# Altium project Modulo Core MK1.PrjPcb (part 1 of 2)
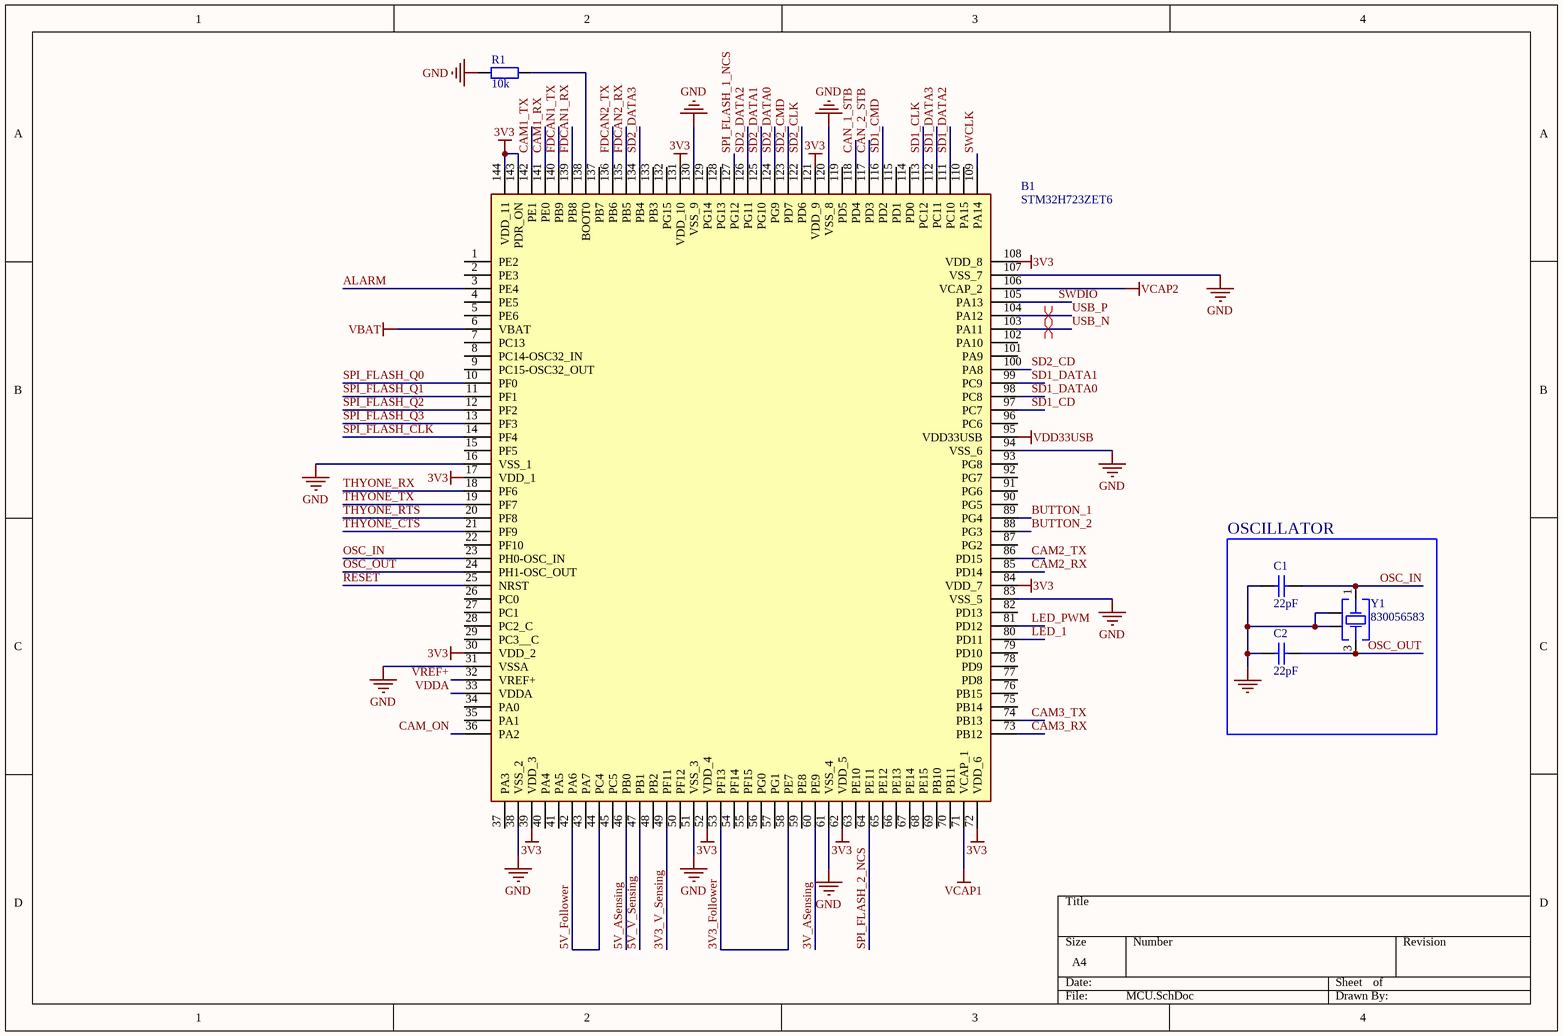
[diagram p0: MCU.SchDoc]
7 sheets, 122 parts. Net scope: global (net labels, ports and power ports of the same name join across sheets).
Board file: PCB_Core.PcbDoc
Sheets:
  MCU.SchDoc
  MCU_PWR.SchDoc
  Connectors.SchDoc
  Sensing.SchDoc
  Comms.SchDoc
  Storage.SchDoc
  Beacons.SchDoc

## Sheet MCU.SchDoc
size A4; SheetNumber: 1; SheetTotal: 7; SPICEModelCacheEMWNTBUM: <root> / <DocumentId>EMWNTBUM</DocumentId> / <CacheFrame Number="0"> / <Model Name="0603_885012006034_22pf" Kind="CKT"> / <Text>******* / .subckt 0603_885012006034_22pF 1 2 / Rser 1 3 0.352481322316 / Lser 2 4 5.8820344E-10 / C1 3 4 0.000000000022 / Rpar 3 4 10000000000 / .ends 0603_885012006034_22pF</Text> / </Model> / </CacheFrame> / </root>

### Parts
B1  STM32H723ZET6  [QFP50P2200X2200X160-144N]
C1  value 22pF  [WCAP-CSGP_0603_L1.6W0.8H0.8_Reflow]  (hidden comment: 885012006034)
C2  value 22pF  [WCAP-CSGP_0603_L1.6W0.8H0.8_Reflow]  (hidden comment: 885012006034)
R1  value 10k  [WRIS-RSKS_0603_Reflow]  (hidden comment: 560112116005)
Y1  830056583  [WE-XTAL_CFPX-104]

### Blocks framed on the sheet
OSCILLATOR: C1 C2 Y1

### Nets
3V3: B1.17(VDD_1) B1.30(VDD_2) B1.39(VDD_3) B1.52(VDD_4) B1.62(VDD_5) B1.72(VDD_6) B1.84(VDD_7) B1.108(VDD_8) B1.121(VDD_9) B1.131(VDD_10) B1.143(PDR_ON) B1.144(VDD_11)  [project net 3V3_Current-]
GND: B1.16(VSS_1) B1.31(VSSA) B1.38(VSS_2) B1.51(VSS_3) B1.61(VSS_4) B1.83(VSS_5) B1.94(VSS_6) B1.107(VSS_7) B1.120(VSS_8) B1.130(VSS_9) C1.2 C2.2 R1.2 Y1.2(GND_&_Lid) Y1.4(GND_&_Lid)
VBAT: B1.6(VBAT)
VCAP1: B1.71(VCAP_1)
VCAP2: B1.106(VCAP_2)
VDD33USB: B1.95(VDD33USB)
VDDA: B1.33(VDDA)
VREF+: B1.32(VREF+)
3V3_Follower: B1.53(PF13) B1.58(PE7)
3V3_V_Sensing: B1.49(PF11)
3V_ASensing: B1.60(PE9)
5V_ASensing: B1.46(PB0)
5V_Follower: B1.42(PA6) B1.44(PC4)
5V_V_Sensing: B1.47(PB1)
ALARM: B1.3(PE4)
BUTTON_1: B1.89(PG4)
BUTTON_2: B1.88(PG3)
CAM1_RX: B1.141(PE0)
CAM1_TX: B1.142(PE1)
CAM2_RX: B1.85(PD14)
CAM2_TX: B1.86(PD15)
CAM3_RX: B1.73(PB12)
CAM3_TX: B1.74(PB13)
CAM_ON: B1.36(PA2)
CAN_1_STB: B1.118(PD4)
CAN_2_STB: B1.117(PD3)
FDCAN1_RX: B1.139(PB8)
FDCAN1_TX: B1.140(PB9)
FDCAN2_RX: B1.135(PB5)
FDCAN2_TX: B1.136(PB6)
LED_1: B1.80(PD11)
LED_PWM: B1.81(PD12)
OSC_IN: B1.23(PH0-OSC_IN) C1.1 Y1.1(Crystal)
OSC_OUT: B1.24(PH1-OSC_OUT) C2.1 Y1.3(Crystal)
RESET: B1.25(NRST)
SD1_CD: B1.97(PC7)
SD1_CLK: B1.113(PC12)
SD1_CMD: B1.116(PD2)
SD1_DATA0: B1.98(PC8)
SD1_DATA1: B1.99(PC9)
SD1_DATA2: B1.111(PC10)
SD1_DATA3: B1.112(PC11)
SD2_CD: B1.100(PA8)
SD2_CLK: B1.122(PD6)
SD2_CMD: B1.123(PD7)
SD2_DATA0: B1.124(PG9)
SD2_DATA1: B1.125(PG10)
SD2_DATA2: B1.126(PG11)
SD2_DATA3: B1.134(PB4)
SPI_FLASH_1_NCS: B1.127(PG12)
SPI_FLASH_2_NCS: B1.64(PE11)
SPI_FLASH_CLK: B1.14(PF4)
SPI_FLASH_Q0: B1.10(PF0)
SPI_FLASH_Q1: B1.11(PF1)
SPI_FLASH_Q2: B1.12(PF2)
SPI_FLASH_Q3: B1.13(PF3)
SWCLK: B1.109(PA14)
SWDIO: B1.105(PA13)
THYONE_CTS: B1.21(PF9)
THYONE_RTS: B1.20(PF8)
THYONE_RX: B1.18(PF6)
THYONE_TX: B1.19(PF7)
USB_N: B1.103(PA11)
USB_P: B1.104(PA12)
NetB1_138: B1.138(BOOT0) R1.1

Not connected (* = marked no-connect by the designer): B1 1(PE2) 2(PE3) 4(PE5) 5(PE6) 7(PC13) 8(PC14-OSC32_IN) 9(PC15-OSC32_OUT) 15(PF5) 22(PF10) 26(PC0) 27(PC1) 28(PC2_C) 29(PC3__C) 34(PA0) 35(PA1) 37(PA3) 40(PA4) 41(PA5) 43(PA7) 45(PC5) 48(PB2) 50(PF12) 54(PF14) 55(PF15) 56(PG0) 57(PG1) 59(PE8) 63(PE10) 65(PE12) 66(PE13) 67(PE14) 68(PE15) 69(PB10) 70(PB11) 75(PB14) 76(PB15) 77(PD8) 78(PD9) 79(PD10) 82(PD13) 87(PG2) 90(PG5) 91(PG6) 92(PG7) 93(PG8) 96(PC6) 101(PA9) 102(PA10) 110(PA15) 114(PD0) 115(PD1) 119(PD5) 128(PG13) 129(PG14) 132(PG15) 133(PB3) 137(PB7)

### Layout directives
differential pair: USB_N, USB_P

### Library data of the parts
B1 = CMP-163-000000-3: High-performance and DSP with DP-FPU, Arm Cortex-M7 MCU with 512 Kbytes Flash, 564 Kbytes RAM, 550 MHz CPU, L1 cache, external memory interface, subset of peripherals; Manufacturer_Name: STMicroelectronics; Geometry.Height: 1.6mm; Source: STM32H723ZET6.SchLib; Mouser Price/Stock: https://www.mouser.co.uk/ProductDetail/STMicroelectronics/STM32H723ZET6?qs=sPbYRqrBIVnvdSB0MwAafg%3D%3D; Datasheet Link: https://www.st.com/resource/en/datasheet/stm32h723ve.pdf; Manufacturer_Part_Number: STM32H723ZET6; Mouser Part Number: 511-STM32H723ZET6; Design Item ID: STM32H723ZET6
C1 C2 = CMP-001-00150-1: WCAP-CSGP Multilayer Ceramic Chip Capacitor, General Purpose, size 0603, NP0, 22pF, 25VDC; Manufacturer: Wurth Elektronik; Q Factor: 840; Capacitance Tolerance: +/-5%; Insulation Resistance: 10GOhm; Technical Reference: NP00603220J025DFCT10000; Rated Voltage (DC): 25V; Category: Multilayer Ceramic Chip Capacitors; ComponentLink2URL: https://www.we-online.com/redexpert/spec/885012006034?ad; ComponentLink1Description: Website Link; Operating Temperature Max: 125°C; Ceramic Type: NP0; Operating Temperature Min: -55°C; Case/Package: 0603; Component Type: Standard; Width: 0.8mm; Source: WCAP-CSGP.SchLib; Pins: 2; Packaging: Tape and Reel; Mount: Surface Mount; ComponentLink2Description: Datasheet Link; ComponentLink1URL: https://www.we-online.com/redexpert/article/885012006034?ad; Manufacturer Part Number: 885012006034; Match Code: WCAP-CSGP; Design Item ID: 885012006034; Length: 1.6mm; Height: 0.8mm
R1 = CMP-009-00328-1: WRIS-RSKS Thick Film Resistor, size 0603, 10000Ohm, 100mW; Manufacturer: Wurth Elektronik; Limiting Element Voltage: 75V; Temperature Coefficient of Resistance Max: 100ppm/°C; Resistance Tolerance: +/-1%; Temperature Coefficient of Resistance Min: -100ppm/°C; ComponentLink1Description: Website Link; Case/Package: 0603; Pins: 2; Match Code: WRIS-RSKS; Operating Temperature Max: 155°C; Width: 0.8mm; Design Item ID: 560112116005; Length: 1.6mm; ComponentLink2Description: Datasheet Link; ComponentLink2URL: https://www.we-online.com/redexpert/spec/560112116005?ad; Packaging: Tape and Reel; Source: WRIS-RSKS.SchLib; Height: 0.45mm; Manufacturer Part Number: 560112116005; Component Type: Standard; Mount: Surface Mount; Operating Temperature Min: -55°C; Rated Power: 100mW; ComponentLink1URL: https://www.we-online.com/redexpert/article/560112116005?ad; Category: Thick Film Resistors
Y1 = CMP-003-00170-1: WE-XTAL Quartz Crystal, SMT, CFPX-104, 10MHz, +/-30ppm; Manufacturer: Wurth Elektronik; Load Capacitance: 12pF; Component Type: Standard; Operating Temperature Min: -40°C; Pins: 4; ComponentLink2URL: https://www.we-online.com/redexpert/spec/830056583?ad; Frequency Tolerance: +/-30ppm; Packaging: Tape and Reel; Match Code: WE-XTAL; Frequency Stability: +/-30ppm; ComponentLink1URL: https://www.we-online.com/redexpert/article/830056583?ad; Mount: Surface Mount; ComponentLink1Description: Website Link; Source: WE-XTAL.SchLib; Length: 5mm; Manufacturer Part Number: 830056583; Width: 3.2mm; Design Item ID: 830056583; Height: 1mm; Frequency: 10MHz; Operating Temperature Max: 85°C; Case/Package: CFPX-104; ComponentLink2Description: Datasheet Link; Category: Crystals

## Sheet MCU_PWR.SchDoc
size A4; SheetNumber: 2; SheetTotal: 7; SPICEModelCacheOZNVDSOE: <root> / <DocumentId>OZNVDSOE</DocumentId> / <CacheFrame Number="0"> / <Model Name="0603_885012206071_100nf" Kind="CKT"> / <Text>******* / .subckt 0603_885012206071_100nF 1 2 / Rser 1 3 0.025 / Lser 2 4 0.0000000008 / C1 3 4 0.0000001 / Rpar 3 4 5000000000 / .ends 0603_885012206071_100nF</Text> / </Model> / <Model Name="0603_885012206052_1uf" Kind="CKT"> / <Text>******* / .subckt 0603_885012206052_1uF 1 2 / Rser 1 3 0.00742821402486 / Lser 2 4 2.51142993E-10 / C1 3 4 0.000001 / Rpar 3 4 100000000 / .ends 0603_885012206052_1uF</Text> / </Model> / <Model Name="0603_885012106012_4.7uf" Kind="CKT"> / <Text>******* / .subckt 0603_885012106012_4.7uF 1 2 / Rser 1 3 0.00455496693599 / Lser 2 4 5.03384516E-10 / C1 3 4 0.0000047 / Rpar 3 4 20000000 / .ends 0603_885012106012_4.7uF</Text> / </Model> / <Model Name="0603_885012106018_2.2uf" Kind="CKT"> / <Text>******* / .subckt 0603_885012106018_2.2uF 1 2 / Rser 1 3 0.00721183501635 / Lser 2 4 2.59345303E-10 / C1 3 4 0.0000022 / Rpar 3 4 50000000 / .ends 0603_885012106018_2.2uF</Text> / </Model> / </CacheFrame> / </root>
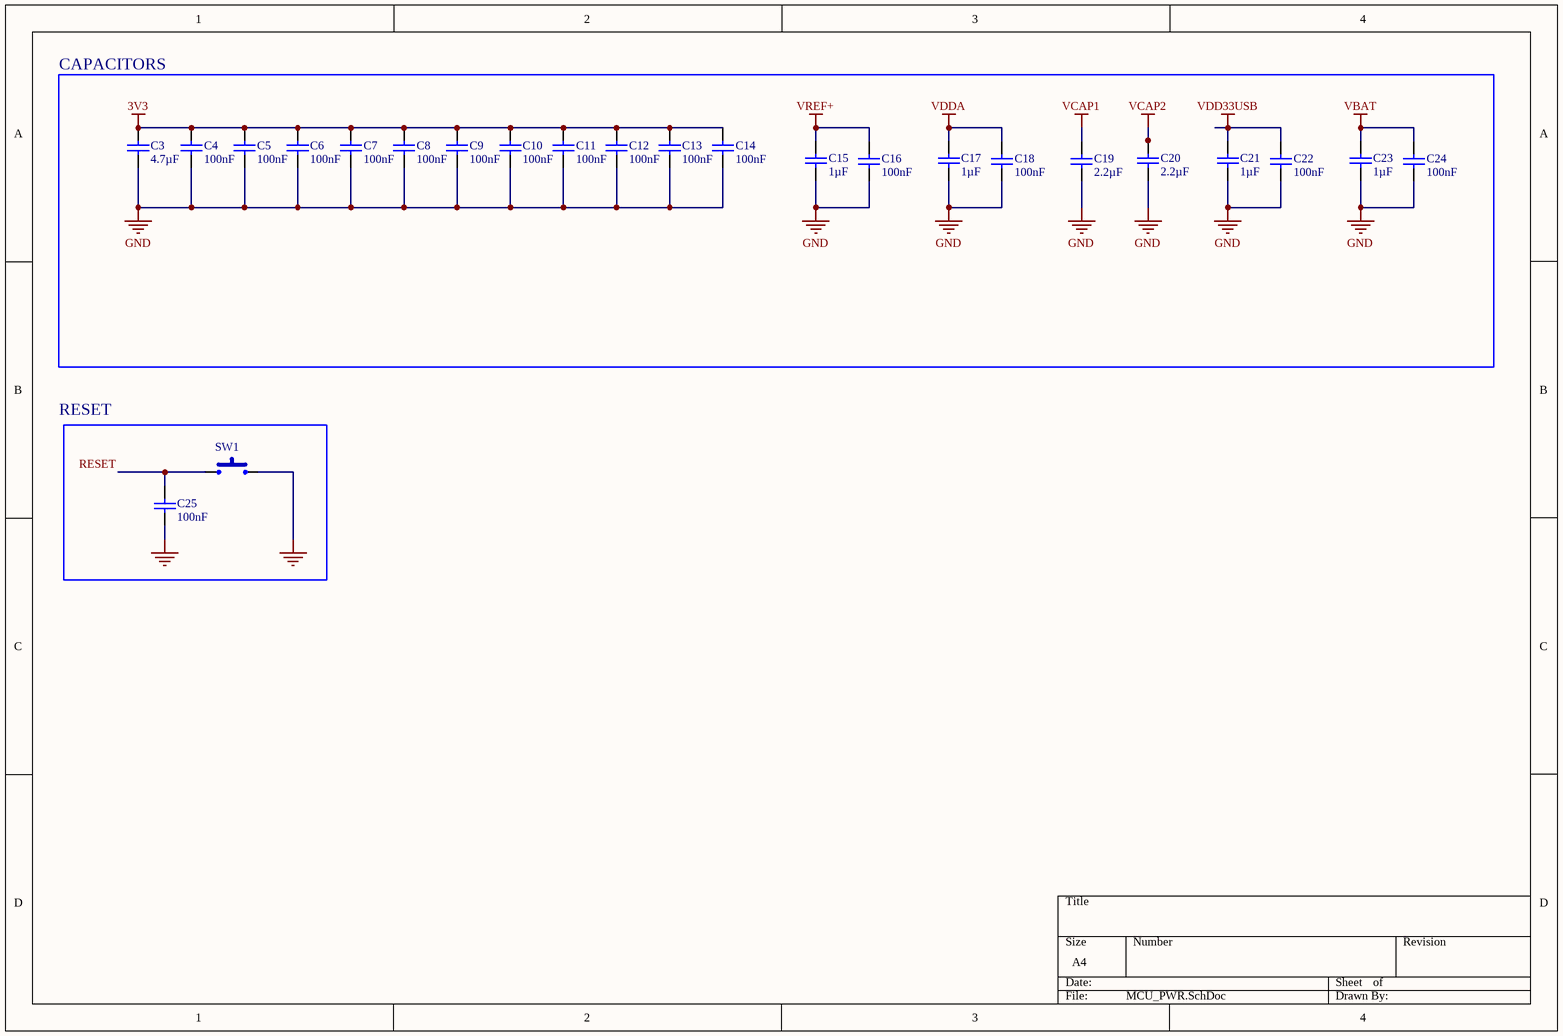
[diagram p1: MCU_PWR.SchDoc]

### Parts
C3  value 4.7µF  [WCAP-CSGP_0603_L1.6W0.8H0.8_Reflow]  (hidden comment: 885012106012)
C4  value 100nF  [WCAP-CSGP_0603_L1.6W0.8H0.8_Reflow]  (hidden comment: 885012206071)
C5  value 100nF  [WCAP-CSGP_0603_L1.6W0.8H0.8_Reflow]  (hidden comment: 885012206071)
C6  value 100nF  [WCAP-CSGP_0603_L1.6W0.8H0.8_Reflow]  (hidden comment: 885012206071)
C7  value 100nF  [WCAP-CSGP_0603_L1.6W0.8H0.8_Reflow]  (hidden comment: 885012206071)
C8  value 100nF  [WCAP-CSGP_0603_L1.6W0.8H0.8_Reflow]  (hidden comment: 885012206071)
C9  value 100nF  [WCAP-CSGP_0603_L1.6W0.8H0.8_Reflow]  (hidden comment: 885012206071)
C10  value 100nF  [WCAP-CSGP_0603_L1.6W0.8H0.8_Reflow]  (hidden comment: 885012206071)
C11  value 100nF  [WCAP-CSGP_0603_L1.6W0.8H0.8_Reflow]  (hidden comment: 885012206071)
C12  value 100nF  [WCAP-CSGP_0603_L1.6W0.8H0.8_Reflow]  (hidden comment: 885012206071)
C13  value 100nF  [WCAP-CSGP_0603_L1.6W0.8H0.8_Reflow]  (hidden comment: 885012206071)
C14  value 100nF  [WCAP-CSGP_0603_L1.6W0.8H0.8_Reflow]  (hidden comment: 885012206071)
C15  value 1µF  [WCAP-CSGP_0603_L1.6W0.8H0.8_Reflow]  (hidden comment: 885012206052)
C16  value 100nF  [WCAP-CSGP_0603_L1.6W0.8H0.8_Reflow]  (hidden comment: 885012206071)
C17  value 1µF  [WCAP-CSGP_0603_L1.6W0.8H0.8_Reflow]  (hidden comment: 885012206052)
C18  value 100nF  [WCAP-CSGP_0603_L1.6W0.8H0.8_Reflow]  (hidden comment: 885012206071)
C19  value 2.2µF  [WCAP-CSGP_0603_L1.6W0.8H0.8_Reflow]  (hidden comment: 885012106018)
C20  value 2.2µF  [WCAP-CSGP_0603_L1.6W0.8H0.8_Reflow]  (hidden comment: 885012106018)
C21  value 1µF  [WCAP-CSGP_0603_L1.6W0.8H0.8_Reflow]  (hidden comment: 885012206052)
C22  value 100nF  [WCAP-CSGP_0603_L1.6W0.8H0.8_Reflow]  (hidden comment: 885012206071)
C23  value 1µF  [WCAP-CSGP_0603_L1.6W0.8H0.8_Reflow]  (hidden comment: 885012206052)
C24  value 100nF  [WCAP-CSGP_0603_L1.6W0.8H0.8_Reflow]  (hidden comment: 885012206071)
C25  value 100nF  [WCAP-CSGP_0603_L1.6W0.8H0.8_Reflow]  (hidden comment: 885012206071)
SW1  PTS815SJM250SMTRLFS  [PTS815SJM250SMTRLFS-Footprint-1]  (value not drawn)

### Blocks framed on the sheet
CAPACITORS: C3-C24

### Nets
3V3: C3.1 C4.1 C5.1 C6.1 C7.1 C8.1 C9.1 C10.1 C11.1 C12.1 C13.1 C14.1  [project net 3V3_Current-]
GND: C3.2 C4.2 C5.2 C6.2 C7.2 C8.2 C9.2 C10.2 C11.2 C12.2 C13.2 C14.2 C15.2 C16.2 C17.2 C18.2 C19.1 C20.1 C21.2 C22.2 C23.2 C24.2 C25.1 SW1.2
VBAT: C23.1 C24.1
VCAP1: C19.2
VCAP2: C20.2
VDD33USB: C21.1 C22.1
VDDA: C17.1 C18.1
VREF+: C15.1 C16.1
RESET: C25.2 SW1.1

### Notes on the sheet
- RESET

### Library data of the parts
C3 = CMP-001-00440-1: WCAP-CSGP Multilayer Ceramic Chip Capacitor, General Purpose, size 0603, X5R, 4.7uF, 10VDC; Manufacturer: Wurth Elektronik; Rated Voltage (DC): 10V; Technical Reference: X5R0603475M010DFCT10000; Dissipation Factor: 10%; Insulation Resistance: 0.02GOhm; Capacitance Tolerance: +/-20%; ComponentLink2URL: https://www.we-online.com/redexpert/spec/885012106012?ad; Height: 0.8mm; Packaging: Tape and Reel; Case/Package: 0603; Manufacturer Part Number: 885012106012; Component Type: Standard; Width: 0.8mm; Match Code: WCAP-CSGP; Mount: Surface Mount; Ceramic Type: X5R; Operating Temperature Max: 85°C; ComponentLink1Description: Website Link; Length: 1.6mm; ComponentLink1URL: https://www.we-online.com/redexpert/article/885012106012?ad; ComponentLink2Description: Datasheet Link; Category: Multilayer Ceramic Chip Capacitors; Source: WCAP-CSGP.SchLib; Operating Temperature Min: -55°C; Pins: 2; Design Item ID: 885012106012
C4-C14 C16 C18 C22 C24 C25 = CMP-001-00661-1: WCAP-CSGP Multilayer Ceramic Chip Capacitor, General Purpose, size 0603, X7R, 100nF, 25VDC; Manufacturer: Wurth Elektronik; Dissipation Factor: 3.5%; Capacitance Tolerance: +/-10%; Insulation Resistance: 5GOhm; Technical Reference: X7R0603104K025DFCT10000; Rated Voltage (DC): 25V; Packaging: Tape and Reel; Height: 0.8mm; Mount: Surface Mount; Source: WCAP-CSGP.SchLib; Component Type: Standard; Category: Multilayer Ceramic Chip Capacitors; Operating Temperature Min: -55°C; Case/Package: 0603; ComponentLink2Description: Datasheet Link; Width: 0.8mm; ComponentLink1URL: https://www.we-online.com/redexpert/article/885012206071?ad; Length: 1.6mm; Operating Temperature Max: 125°C; Match Code: WCAP-CSGP; ComponentLink2URL: https://www.we-online.com/redexpert/spec/885012206071?ad; Design Item ID: 885012206071; ComponentLink1Description: Website Link; Manufacturer Part Number: 885012206071; Pins: 2; Ceramic Type: X7R
C15 C17 C21 C23 = CMP-001-00642-1: WCAP-CSGP Multilayer Ceramic Chip Capacitor, General Purpose, size 0603, X7R, 1uF, 16VDC; Manufacturer: Wurth Elektronik; Capacitance Tolerance: +/-10%; Insulation Resistance: 0.1GOhm; Rated Voltage (DC): 16V; Dissipation Factor: 10%; Technical Reference: X7R0603105K016DFCT10000; Component Type: Standard; Width: 0.8mm; Ceramic Type: X7R; ComponentLink1Description: Website Link; ComponentLink1URL: https://www.we-online.com/redexpert/article/885012206052?ad; Height: 0.8mm; Manufacturer Part Number: 885012206052; Match Code: WCAP-CSGP; Source: WCAP-CSGP.SchLib; Case/Package: 0603; Operating Temperature Min: -55°C; ComponentLink2Description: Datasheet Link; Design Item ID: 885012206052; ComponentLink2URL: https://www.we-online.com/redexpert/spec/885012206052?ad; Category: Multilayer Ceramic Chip Capacitors; Packaging: Tape and Reel; Pins: 2; Length: 1.6mm; Operating Temperature Max: 125°C; Mount: Surface Mount
C19 C20 = CMP-001-00446-1: WCAP-CSGP Multilayer Ceramic Chip Capacitor, General Purpose, size 0603, X5R, 2.2uF, 16VDC; Manufacturer: Wurth Elektronik; Rated Voltage (DC): 16V; Insulation Resistance: 0.05GOhm; Dissipation Factor: 10%; Technical Reference: X5R0603225M016DFCT10000; Capacitance Tolerance: +/-20%; Height: 0.8mm; Length: 1.6mm; Packaging: Tape and Reel; Match Code: WCAP-CSGP; Ceramic Type: X5R; Category: Multilayer Ceramic Chip Capacitors; Source: WCAP-CSGP.SchLib; Width: 0.8mm; Design Item ID: 885012106018; Case/Package: 0603; Mount: Surface Mount; Component Type: Standard; Pins: 2; ComponentLink1URL: https://www.we-online.com/redexpert/article/885012106018?ad; Operating Temperature Min: -55°C; ComponentLink1Description: Website Link; Operating Temperature Max: 85°C; Manufacturer Part Number: 885012106018; ComponentLink2URL: https://www.we-online.com/redexpert/spec/885012106018?ad; ComponentLink2Description: Datasheet Link
SW1 = CMP-011-00002-1: Keypad Switch, 1 Switches, SPST, Momentary-tactile, 0.05A, 12VDC, 2.26N, Solder Terminal, Surface Mount-straight

## Sheet Connectors.SchDoc
size A4; SheetNumber: 3; SheetTotal: 7; SPICEModelCacheZWOSRZDM: <root> / <DocumentId>ZWOSRZDM</DocumentId> / </root>
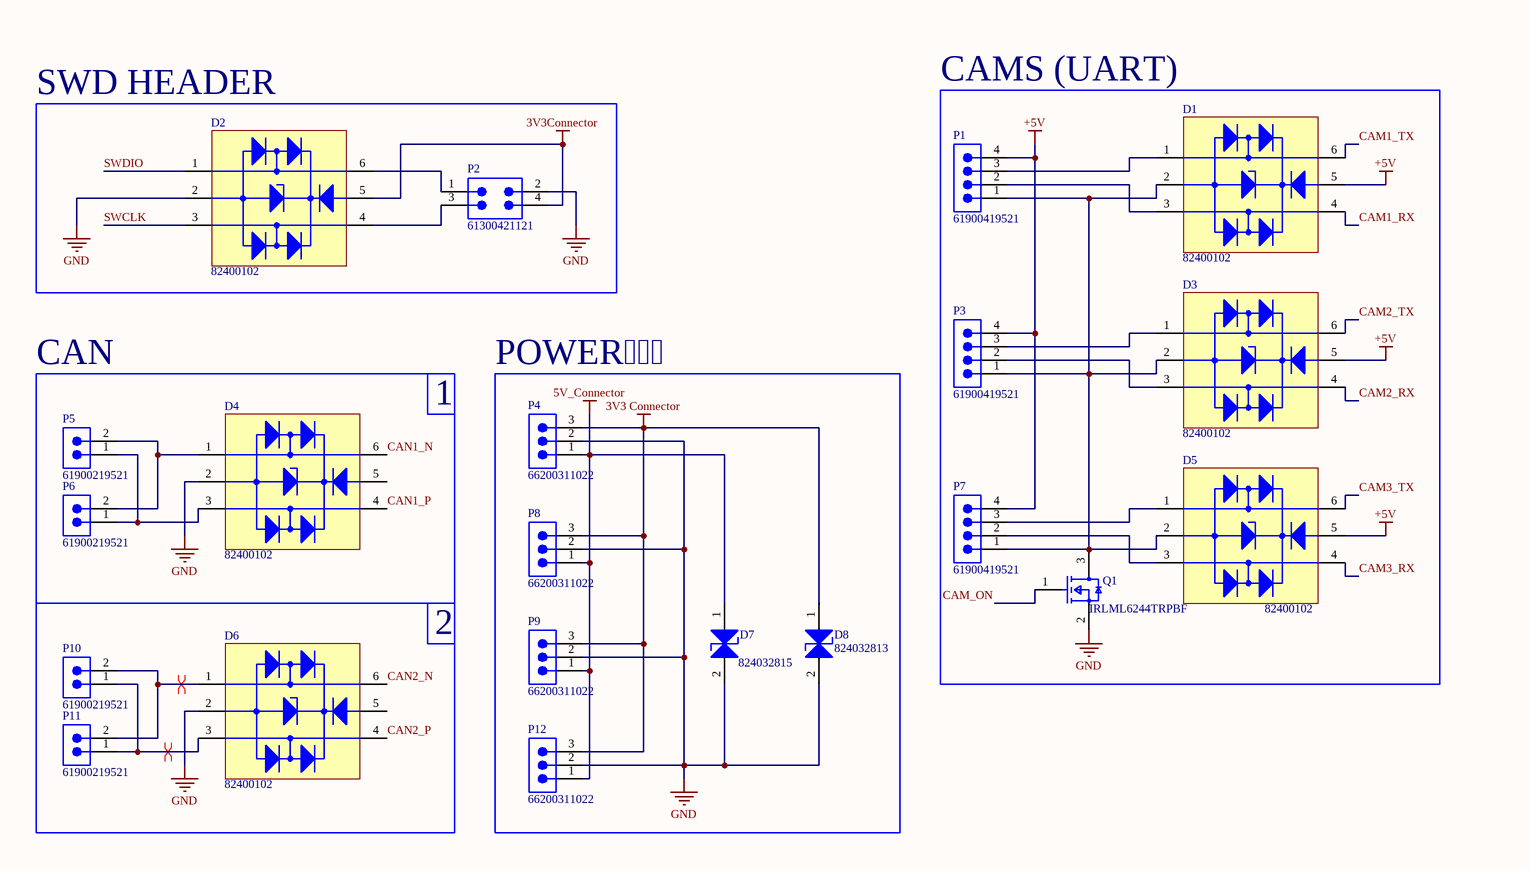
[diagram p2: Connectors.SchDoc, left]
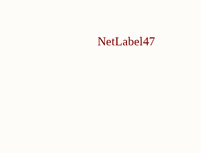
[diagram p3: Connectors.SchDoc, right]

### Parts
D1  82400102  [WE-TVS_SOT23-6L]
D2  82400102  [WE-TVS_SOT23-6L]
D3  82400102  [WE-TVS_SOT23-6L]
D4  82400102  [WE-TVS_SOT23-6L]
D5  82400102  [WE-TVS_SOT23-6L]
D6  82400102  [WE-TVS_SOT23-6L]
D7  824032815  [WE-TVS_DFN1610-2L]
D8  824032813  [WE-TVS_DFN1610-2L]
P1  61900419521  [61900419521]
P2  61300421121  [61300421121]
P3  61900419521  [61900419521]
P4  66200311022  [66200311022]
P5  61900219521  [61900219521]
P6  61900219521  [61900219521]
P7  61900419521  [61900419521]
P8  66200311022  [66200311022]
P9  66200311022  [66200311022]
P10  61900219521  [61900219521]
P11  61900219521  [61900219521]
P12  66200311022  [66200311022]
Q1  IRLML6244TRPBF  [FP-Micro3-IPC_C]

### Blocks framed on the sheet
CAMS (UART): D1 D3 D5 P1 P3 P7 Q1
SWD HEADER: D2 P2
POWER: D7 D8 P4 P8 P9 P12

### Nets
3V3 Connector: D8.1(I/O_1) P4.3 P8.3 P9.3 P12.3  [project net 3V3_Current+]
3V3Connector: D2.5(VDD) P2.4
5V_Connector: D7.1(I/O_1) P4.1 P8.1 P9.1 P12.1  [project net 5V_Current+]
+5V: D1.5(VDD) D3.5(VDD) D5.5(VDD) P1.4 P3.4 P7.4  [project net 5V_Current-]
GND: D2.2(GND) D4.2(GND) D6.2(GND) D7.2(GND) D8.2(GND) P2.2 P4.2 P8.2 P9.2 P12.2 Q1.2(S)
CAM1_RX: D1.4(I/O_2)
CAM1_TX: D1.6(I/O_1)
CAM2_RX: D3.4(I/O_2)
CAM2_TX: D3.6(I/O_1)
CAM3_RX: D5.4(I/O_2)
CAM3_TX: D5.6(I/O_1)
CAM_ON: Q1.1(G)
CAN1_N: D4.6(I/O_1)
CAN1_P: D4.4(I/O_2)
CAN2_N: D6.6(I/O_1)
CAN2_P: D6.4(I/O_2)
SWCLK: D2.3(I/O_2)
SWDIO: D2.1(I/O_1)
NetD1_1: D1.1(I/O_1) P1.3
NetD1_2: D1.2(GND) D3.2(GND) D5.2(GND) P1.1 P3.1 P7.1 Q1.3(D)
NetD1_3: D1.3(I/O_2) P1.2
NetD2_4: D2.4(I/O_2) P2.3
NetD2_6: D2.6(I/O_1) P2.1
NetD3_1: D3.1(I/O_1) P3.3
NetD3_3: D3.3(I/O_2) P3.2
NetD4_1: D4.1(I/O_1) P5.2 P6.2
NetD4_3: D4.3(I/O_2) P5.1 P6.1
NetD5_1: D5.1(I/O_1) P7.3
NetD5_3: D5.3(I/O_2) P7.2
NetD6_1: D6.1(I/O_1) P10.2 P11.2
NetD6_3: D6.3(I/O_2) P10.1 P11.1

Not connected (* = marked no-connect by the designer): D4 5(VDD); D6 5(VDD)

### Layout directives
differential pair: NetD6_1, NetD6_3

### Notes on the sheet
- CAN
- 1
- 2
- Labels drawn without touching a wire or pin: NetLabel47

### Library data of the parts
D1-D6 = CMP-004-00017-1: WE-TVS TVS Diode – High Speed Series, SOT23-6L, 2+1 Channel, 5V, 2pF; Manufacturer: Wurth Elektronik; Polarity: Unidirectional; Channel ESD Clamping Voltage: 10V; ESD Air Discharge Capability: 15kV; (Reverse) Peak Pulse Current: 7A; (Reverse) Breakdown Voltage: 6V; Channel Reverse Leakage Current: 1uA; ESD Contact Discharge Capability: 8kV; Source: WE-TVS.SchLib; Component Type: Standard; Packaging: Tape and Reel; Height: 1.45mm; Pins: 6; Match Code: WE-TVS; Case/Package: SOT23-6L; Mount: Surface Mount; Channel Operating Voltage: 5V; ComponentLink1Description: Website Link; ComponentLink2URL: https://www.we-online.com/redexpert/spec/82400102?ad; Category: ESD Protection; Channel Input Capacitance: 2pF; Operating Temperature Min: -40°C; ComponentLink1URL: https://www.we-online.com/redexpert/article/82400102?ad; Length: 2.9mm; Width: 2.8mm; Manufacturer Part Number: 82400102; Design Item ID: 82400102; ComponentLink2Description: Datasheet Link; Operating Temperature Max: 125°C; Number of Channels: 2+1
D7 = CMP-03913-133963841-1: 824032815 Tvs Diode, Bidir, 5V, Dfn1610 Rohs Compliant: Yes; Min Operating Temperature: -55°C; Width: 1mm; NexarPartId: 133963841; Length: 1.6mm; RoHS: Compliant; Max Operating Temperature: 85°C; Height: 500µm
D8 = CMP-03913-133963840-1: 824032813 Tvs Diode, Bidir, 3.3V, Dfn1610 Rohs Compliant: Yes; Width: 1mm; NexarPartId: 133963840; Min Operating Temperature: -55°C; Max Operating Temperature: 125°C; Height: 500µm; Length: 1.6mm; RoHS: Compliant
P1 P3 P7 = CMP-002-00294-1: WR-WTB THT Male Right Angled Top Locking Header, pitch 2.54mm, 4pins; Manufacturer: Wurth Elektronik; Contact Resistance: 20mOhm; Withstanding Voltage: 1000VAC; Working Voltage: 250VAC; Rated Current: 3A; Operating Temperature Max: 105°C; Category: Wire-to-Board Connectors; Mount: Through Hole; Pin Count: 4; Design Item ID: 61900419521; ComponentLink2URL: https://www.we-online.com/redexpert/spec/61900419521?ad; Source: WR-WTB.SchLib; ComponentLink2Description: Datasheet Link; ComponentLink1URL: https://www.we-online.com/redexpert/article/61900419521?ad; Pins: 4; Number of Rows: 1; Height: 5.8mm; Component Type: Standard; Orientation: Right Angled Top Locking; Gender: Male; Packaging: Bag; ComponentLink1Description: Website Link; Manufacturer Part Number: 61900419521; Match Code: WR-WTB; Operating Temperature Min: -40°C; Width: 12.47mm; Pitch: 2.54mm; Length: 10.16mm
P2 = CMP-002-00747-2: Board Connector, 4 Contact(s), 2 Row(s), Male, Straight, 0.1 inch Pitch, Solder Terminal, Black Insulator, Plug; RoHS Compliant: Yes; Min Operating Temperature: -40°C; Mounting Technology: Board; Connector Type: BOARD CONNECTOR; Max Operating Temperature: 125°C
P4 P8 P9 P12 = CMP-002-00023-2: WR-MPC3 THT Male Right Angled Header with Plastic Pegs, pitch 3mm, 3p; Manufacturer: Wurth Elektronik; Contact Resistance: 10mOhm; Rated Current: 5A; Insulation Resistance: >1000MOhm; Working Voltage: 250V (AC); ComponentLink1URL: https://www.we-online.com/redexpert/article/66200311022?ad; Design Item ID: 66200311022; Number of Rows: 1; ComponentLink1Description: Website Link; ComponentLink2Description: Datasheet Link; Pins: 3; Gender: Male; Component Type: Standard; Operating Temperature Max: 105°C; Manufacturer Part Number: 66200311022; Category: Wire-to-Board Connectors; Source: WR-MPC3.SchLib; Pitch: 3mm; ComponentLink2URL: https://www.we-online.com/redexpert/spec/66200311022?ad; Mount: Through Hole; Operating Temperature Min: -40°C; Height: 5.57mm; Orientation: Right Angled; Length: 12.65mm; Width: 9.9mm; Pin Count: 3; Packaging: Tube; Match Code: WR-MPC3
P5 P6 P10 P11 = CMP-002-00288-1: WR-WTB THT Male Right Angled Top Locking Header, pitch 2.54mm, 2pins; Manufacturer: Wurth Elektronik; Working Voltage: 250VAC; Contact Resistance: 20mOhm; Rated Current: 3A; Withstanding Voltage: 1000VAC; Number of Rows: 1; Length: 5.08mm; ComponentLink1URL: https://www.we-online.com/redexpert/article/61900219521?ad; Mount: Through Hole; ComponentLink2Description: Datasheet Link; Pins: 2; Width: 12.47mm; Height: 5.8mm; Component Type: Standard; Orientation: Right Angled Top Locking; Match Code: WR-WTB; Design Item ID: 61900219521; Pitch: 2.54mm; ComponentLink2URL: https://www.we-online.com/redexpert/spec/61900219521?ad; Manufacturer Part Number: 61900219521; ComponentLink1Description: Website Link; Packaging: Bag; Gender: Male; Pin Count: 2; Operating Temperature Max: 105°C; Source: WR-WTB.SchLib; Category: Wire-to-Board Connectors; Operating Temperature Min: -40°C
Q1 = CMP-013-00010-1: Power Field-Effect Transistor, 6.3A I(D), 20V, 0.021ohm, 1-Element, N-Channel, Silicon, Metal-oxide Semiconductor FET, TO-236AB; RoHS Compliant: Yes; Max Operating Temperature: 150°C; Pins: 3

## Sheet Sensing.SchDoc
size A4; SheetNumber: 4; SheetTotal: 7; SPICEModelCacheKMZCHKNF: <root> / <DocumentId>KMZCHKNF</DocumentId> / <CacheFrame Number="0"> / <Model Name="0603_885012206062_3.3nf" Kind="CKT"> / <Text>******* / .subckt 0603_885012206062_3.3nF 1 2 / Rser 1 3 0.09865 / Lser 2 4 0.0000000003316 / C1 3 4 0.0000000033 / Rpar 3 4 10000000000 / .ends 0603_885012206062_3.3nF</Text> / </Model> / </CacheFrame> / </root>
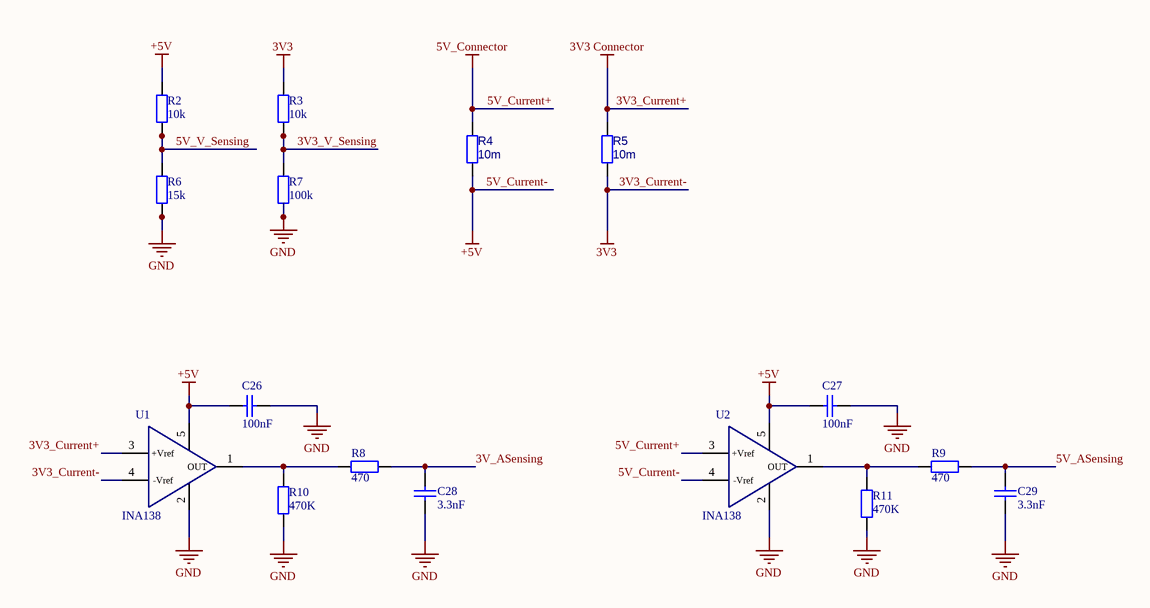
[diagram p4: Sensing.SchDoc]

### Parts
C26  value 100nF  [WCAP-CSGP_0603_L1.6W0.8H0.8_Reflow]  (hidden comment: 885012206071)
C27  value 100nF  [WCAP-CSGP_0603_L1.6W0.8H0.8_Reflow]  (hidden comment: 885012206071)
C28  value 3.3nF  [WCAP-CSGP_0603_L1.6W0.8H0.8_Reflow]  (hidden comment: 885012206062)
C29  value 3.3nF  [WCAP-CSGP_0603_L1.6W0.8H0.8_Reflow]  (hidden comment: 885012206062)
R2  value 10k  [WRIS-RSKS_0603_Reflow]  (hidden comment: 560112116005)
R3  value 10k  [WRIS-RSKS_0603_Reflow]  (hidden comment: 560112116005)
R4  10m  [580070763010-Footprint-1]
R5  10m  [580070763010-Footprint-1]
R6  value 15k  [WRIS-RSKS_0603_Reflow]  (hidden comment: 560112116035)
R7  value 100k  [WRIS-RSKS_0603_Reflow]  (hidden comment: 560112116004)
R8  value 470  [WRIS-RSKS_0603_Reflow]  (hidden comment: 560112116067)
R9  value 470  [WRIS-RSKS_0603_Reflow]  (hidden comment: 560112116067)
R10  value 470K  [WRIS-RSKS_0603_Reflow]  (hidden comment: 560112116019)
R11  value 470K  [WRIS-RSKS_0603_Reflow]  (hidden comment: 560112116019)
U1  INA138  [INA138-Footprint-1]
U2  INA138  [INA138-Footprint-1]

### Nets
3V3_Current+: R5.2 U1.3(+Vref)  [also labelled 3V3 Connector]
3V3_Current-: R3.2 R5.1 U1.4(-Vref)  [also labelled 3V3]
5V_Current+: R4.2 U2.3(+Vref)  [also labelled 5V_Connector]
5V_Current-: C26.2 C27.2 R2.2 R4.1 U1.5(V+) U2.4(-Vref) U2.5(V+)  [also labelled +5V]
GND: C26.1 C27.1 C28.1 C29.1 R6.1 R7.1 R10.1 R11.1 U1.2(GND) U2.2(GND)
3V3_V_Sensing: R3.1 R7.2
3V_ASensing: C28.2 R8.2
5V_ASensing: C29.2 R9.2
5V_V_Sensing: R2.1 R6.2
NetR8_1: R8.1 R10.2 U1.1(OUT)
NetR9_1: R9.1 R11.2 U2.1(OUT)

### Library data of the parts
C26 C27 = CMP-001-00661-1: as C4 on sheet MCU_PWR; Packaging: Tape and Reel; Height: 0.8mm; Mount: Surface Mount; Source: WCAP-CSGP.SchLib; Component Type: Standard; Category: Multilayer Ceramic Chip Capacitors; Operating Temperature Min: -55°C; Case/Package: 0603; ComponentLink2Description: Datasheet Link; Width: 0.8mm; ComponentLink1URL: https://www.we-online.com/redexpert/article/885012206071?ad; Length: 1.6mm; Operating Temperature Max: 125°C; Match Code: WCAP-CSGP; ComponentLink2URL: https://www.we-online.com/redexpert/spec/885012206071?ad; Design Item ID: 885012206071; ComponentLink1Description: Website Link; Manufacturer Part Number: 885012206071; Pins: 2; Ceramic Type: X7R
C28 C29 = CMP-001-00652-1: WCAP-CSGP Multilayer Ceramic Chip Capacitor, General Purpose, size 0603, X7R, 3.3nF, 25VDC; Manufacturer: Wurth Elektronik; Capacitance Tolerance: +/-10%; Technical Reference: X7R0603332K025DFCT10000; Dissipation Factor: 3.5%; Rated Voltage (DC): 25V; Insulation Resistance: 10GOhm; ComponentLink2Description: Datasheet Link; Source: WCAP-CSGP.SchLib; Pins: 2; Operating Temperature Min: -55°C; Length: 1.6mm; ComponentLink2URL: https://www.we-online.com/redexpert/spec/885012206062?ad; Ceramic Type: X7R; Manufacturer Part Number: 885012206062; ComponentLink1URL: https://www.we-online.com/redexpert/article/885012206062?ad; ComponentLink1Description: Website Link; Mount: Surface Mount; Case/Package: 0603; Packaging: Tape and Reel; Component Type: Standard; Height: 0.8mm; Operating Temperature Max: 125°C; Width: 0.8mm; Match Code: WCAP-CSGP; Category: Multilayer Ceramic Chip Capacitors; Design Item ID: 885012206062
R2 R3 = CMP-009-00328-1: as R1 on sheet MCU; ComponentLink1Description: Website Link; Case/Package: 0603; Pins: 2; Match Code: WRIS-RSKS; Operating Temperature Max: 155°C; Width: 0.8mm; Design Item ID: 560112116005; Length: 1.6mm; ComponentLink2Description: Datasheet Link; ComponentLink2URL: https://www.we-online.com/redexpert/spec/560112116005?ad; Packaging: Tape and Reel; Source: WRIS-RSKS.SchLib; Height: 0.45mm; Manufacturer Part Number: 560112116005; Component Type: Standard; Mount: Surface Mount; Operating Temperature Min: -55°C; Rated Power: 100mW; ComponentLink1URL: https://www.we-online.com/redexpert/article/560112116005?ad; Category: Thick Film Resistors
R4 R5 = CMP-009-00124-2: Res, 0R01, 1%, 2W, Metal Foil, 0612 Rohs Compliant: Yes
R6 = CMP-009-00358-1: WRIS-RSKS Thick Film Resistor, size 0603, 15000Ohm, 100mW; Manufacturer: Wurth Elektronik; Limiting Element Voltage: 75V; Temperature Coefficient of Resistance Min: -100ppm/°C; Resistance Tolerance: +/-1%; Temperature Coefficient of Resistance Max: 100ppm/°C; Match Code: WRIS-RSKS; Design Item ID: 560112116035; Case/Package: 0603; ComponentLink2URL: https://www.we-online.com/redexpert/spec/560112116035?ad; Category: Thick Film Resistors; Source: WRIS-RSKS.SchLib; ComponentLink2Description: Datasheet Link; Pins: 2; ComponentLink1Description: Website Link; Operating Temperature Max: 155°C; Height: 0.45mm; Length: 1.6mm; Component Type: Standard; Packaging: Tape and Reel; Manufacturer Part Number: 560112116035; Width: 0.8mm; Rated Power: 100mW; Mount: Surface Mount; ComponentLink1URL: https://www.we-online.com/redexpert/article/560112116035?ad; Operating Temperature Min: -55°C
R7 = CMP-009-00327-1: WRIS-RSKS Thick Film Resistor, size 0603, 100000Ohm, 100mW; Manufacturer: Wurth Elektronik; Temperature Coefficient of Resistance Min: -100ppm/°C; Resistance Tolerance: +/-1%; Limiting Element Voltage: 75V; Temperature Coefficient of Resistance Max: 100ppm/°C; Height: 0.45mm; ComponentLink1URL: https://www.we-online.com/redexpert/article/560112116004?ad; Packaging: Tape and Reel; Match Code: WRIS-RSKS; Operating Temperature Max: 155°C; ComponentLink2Description: Datasheet Link; ComponentLink1Description: Website Link; Category: Thick Film Resistors; Operating Temperature Min: -55°C; Length: 1.6mm; Source: WRIS-RSKS.SchLib; Rated Power: 100mW; Mount: Surface Mount; Manufacturer Part Number: 560112116004; ComponentLink2URL: https://www.we-online.com/redexpert/spec/560112116004?ad; Component Type: Standard; Width: 0.8mm; Case/Package: 0603; Pins: 2; Design Item ID: 560112116004
R8 R9 = CMP-009-00390-1: WRIS-RSKS Thick Film Resistor, size 0603, 470Ohm, 100mW; Manufacturer: Wurth Elektronik; Limiting Element Voltage: 75V; Temperature Coefficient of Resistance Max: 100ppm/°C; Resistance Tolerance: +/-1%; Temperature Coefficient of Resistance Min: -100ppm/°C; Rated Power: 100mW; Height: 0.45mm; ComponentLink2Description: Datasheet Link; Component Type: Standard; ComponentLink1URL: https://www.we-online.com/redexpert/article/560112116067?ad; ComponentLink1Description: Website Link; Operating Temperature Min: -55°C; Match Code: WRIS-RSKS; Mount: Surface Mount; Case/Package: 0603; Source: WRIS-RSKS.SchLib; Length: 1.6mm; Category: Thick Film Resistors; Operating Temperature Max: 155°C; Pins: 2; Packaging: Tape and Reel; Manufacturer Part Number: 560112116067; ComponentLink2URL: https://www.we-online.com/redexpert/spec/560112116067?ad; Width: 0.8mm; Design Item ID: 560112116067
R10 R11 = CMP-009-00342-1: WRIS-RSKS Thick Film Resistor, size 0603, 470000Ohm, 100mW; Manufacturer: Wurth Elektronik; Temperature Coefficient of Resistance Min: -100ppm/°C; Resistance Tolerance: +/-1%; Limiting Element Voltage: 75V; Temperature Coefficient of Resistance Max: 100ppm/°C; Component Type: Standard; ComponentLink2URL: https://www.we-online.com/redexpert/spec/560112116019?ad; ComponentLink1Description: Website Link; Height: 0.45mm; Source: WRIS-RSKS.SchLib; ComponentLink1URL: https://www.we-online.com/redexpert/article/560112116019?ad; Category: Thick Film Resistors; Mount: Surface Mount; Operating Temperature Min: -55°C; Rated Power: 100mW; Pins: 2; Packaging: Tape and Reel; Match Code: WRIS-RSKS; Width: 0.8mm; ComponentLink2Description: Datasheet Link; Design Item ID: 560112116019; Operating Temperature Max: 155°C; Manufacturer Part Number: 560112116019; Length: 1.6mm; Case/Package: 0603
U1 U2 = CMP-014-00004-3: Shunt Current Measure Amplifier; Manufacturer: Texas Instruments; Manufacturer Part Number: INA138NA/3K; ClassName: 1Pyro OPAMP

## Sheet Comms.SchDoc
size A4; SheetNumber: 5; SheetTotal: 7; SPICEModelCacheWWCEIBKB: <root> / <DocumentId>WWCEIBKB</DocumentId> / <CacheFrame Number="0"> / <Model Name="0603_885012106012_4.7uf" Kind="CKT"> / <Text>******* / .subckt 0603_885012106012_4.7uF 1 2 / Rser 1 3 0.00455496693599 / Lser 2 4 5.03384516E-10 / C1 3 4 0.0000047 / Rpar 3 4 20000000 / .ends 0603_885012106012_4.7uF</Text> / </Model> / <Model Name="0603_885012206071_100nf" Kind="CKT"> / <Text>******* / .subckt 0603_885012206071_100nF 1 2 / Rser 1 3 0.025 / Lser 2 4 0.0000000008 / C1 3 4 0.0000001 / Rpar 3 4 5000000000 / .ends 0603_885012206071_100nF</Text> / </Model> / </CacheFrame> / </root>
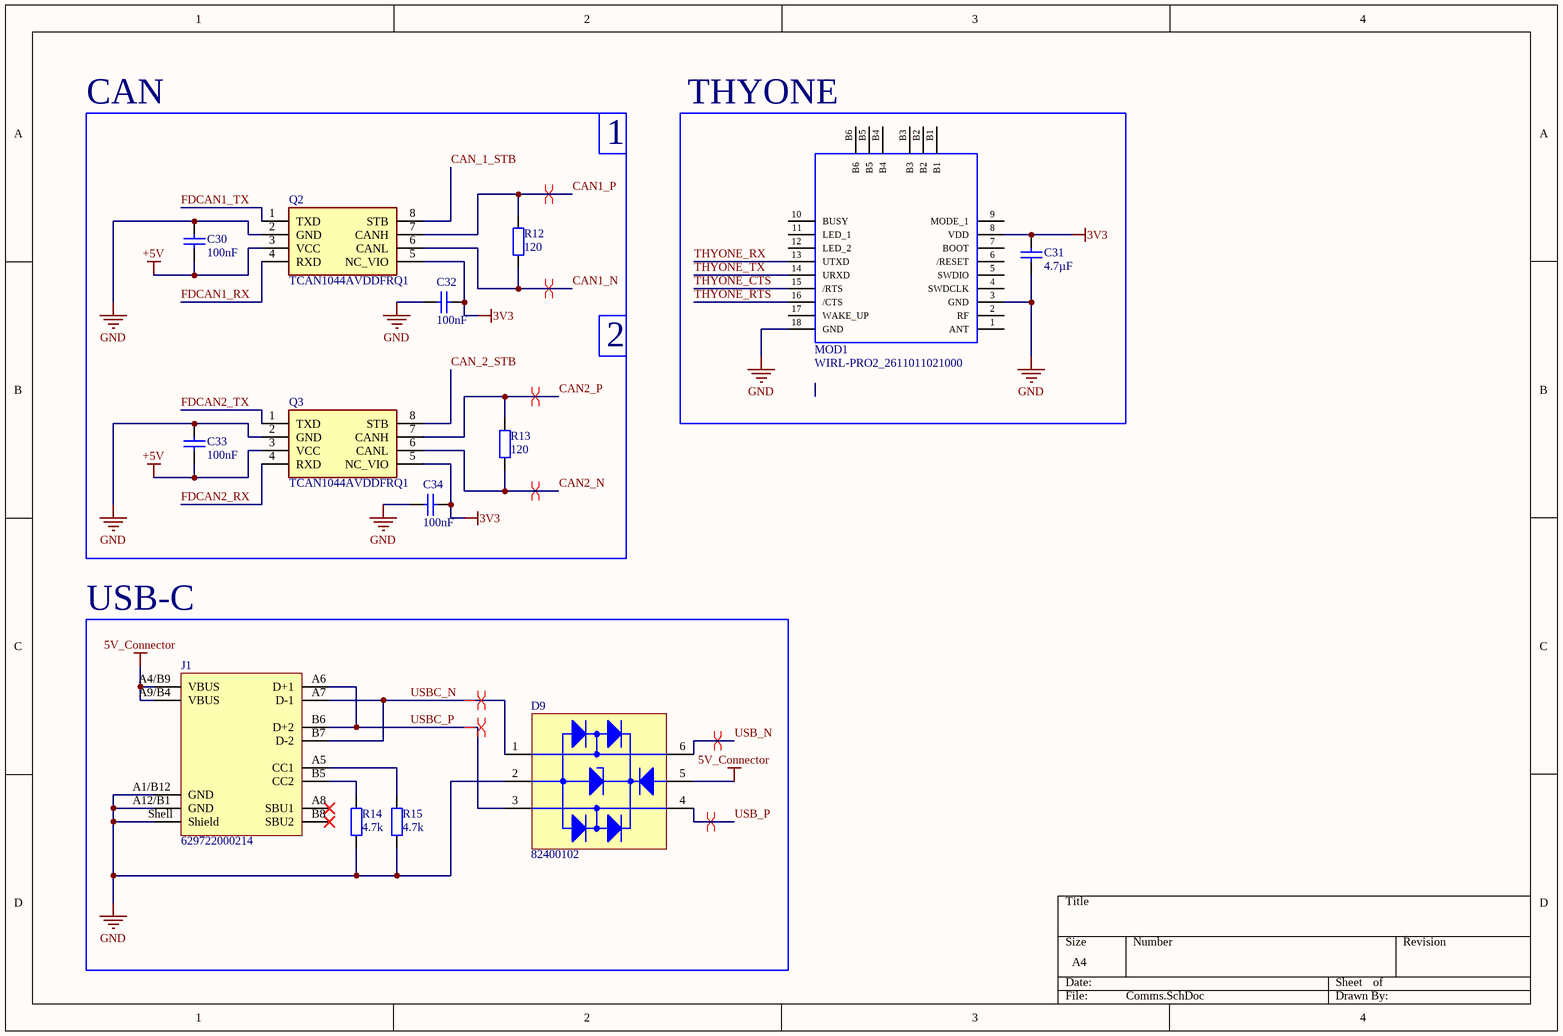
[diagram p5: Comms.SchDoc]

### Parts
C30  value 100nF  [WCAP-CSGP_0603_L1.6W0.8H0.8_Reflow]  (hidden comment: 885012206071)
C31  value 4.7µF  [WCAP-CSGP_0603_L1.6W0.8H0.8_Reflow]  (hidden comment: 885012106012)
C32  value 100nF  [WCAP-CSGP_0603_L1.6W0.8H0.8_Reflow]  (hidden comment: 885012206071)
C33  value 100nF  [WCAP-CSGP_0603_L1.6W0.8H0.8_Reflow]  (hidden comment: 885012206071)
C34  value 100nF  [WCAP-CSGP_0603_L1.6W0.8H0.8_Reflow]  (hidden comment: 885012206071)
D9  82400102  [WE-TVS_SOT23-6L]
J1  629722000214  [629722000214]
MOD1  WIRL-PRO2_2611011021000  [WE-FP-4+]
Q2  TCAN1044AVDDFRQ1  [FP-DDF0008A-MFG]
Q3  TCAN1044AVDDFRQ1  [FP-DDF0008A-MFG]
R12  value 120  [RCS0805120RFKEA-Footprint-1]  (hidden comment: RCS0805120RFKEA)
R13  value 120  [RCS0805120RFKEA-Footprint-1]  (hidden comment: RCS0805120RFKEA)
R14  value 4.7k  [WRIS-RSKS_0603_Reflow]  (hidden comment: 560112116006)
R15  value 4.7k  [WRIS-RSKS_0603_Reflow]  (hidden comment: 560112116006)

### Blocks framed on the sheet
THYONE: C31 MOD1
USB-C: D9 J1 R14 R15

### Nets
3V3: C31.1 C32.1 C34.1 MOD1.8(VDD) Q2.5(NC_VIO) Q3.5(NC_VIO)  [project net 3V3_Current-]
5V_Connector: D9.5(VDD) J1.A4/B9(VBUS) J1.A9/B4(VBUS)  [project net 5V_Current+]
+5V: C30.1 C33.1 Q2.3(VCC) Q3.3(VCC)  [project net 5V_Current-]
GND: C30.2 C31.2 C32.2 C33.2 C34.2 D9.2(GND) J1.A1/B12(GND) J1.A12/B1(GND) J1.Shell(Shield) MOD1.3(GND) MOD1.18(GND) Q2.2(GND) Q3.2(GND) R14.2 R15.2
CAN1_N: Q2.6(CANL) R12.1
CAN1_P: Q2.7(CANH) R12.2
CAN2_N: Q3.6(CANL) R13.1
CAN2_P: Q3.7(CANH) R13.2
CAN_1_STB: Q2.8(STB)
CAN_2_STB: Q3.8(STB)
FDCAN1_RX: Q2.4(RXD)
FDCAN1_TX: Q2.1(TXD)
FDCAN2_RX: Q3.4(RXD)
FDCAN2_TX: Q3.1(TXD)
THYONE_CTS: MOD1.15(/RTS)
THYONE_RTS: MOD1.16(/CTS)
THYONE_RX: MOD1.13(UTXD)
THYONE_TX: MOD1.14(URXD)
USB_N: D9.6(I/O_1)
USB_P: D9.4(I/O_2)
USBC_N: D9.1(I/O_1) J1.A7(D-1) J1.B7(D-2)
USBC_P: D9.3(I/O_2) J1.A6(D+1) J1.B6(D+2)
NetJ1_A5: J1.A5(CC1) R15.1
NetJ1_B5: J1.B5(CC2) R14.1

Not connected (* = marked no-connect by the designer): J1 A8(SBU1)* B8(SBU2)*; MOD1 1(ANT) 2(RF) 4(SWDCLK) 5(SWDIO) 6(/RESET) 7(BOOT) 9(MODE_1) 10(BUSY) 11(LED_1) 12(LED_2) 17(WAKE_UP) B1 B2 B3 B4 B5 B6

### Layout directives
differential pair: CAN1_N, CAN1_P, CAN2_N, CAN2_P, USB_N, USB_P, USBC_N, USBC_P

### Notes on the sheet
- CAN
- 1
- 2

### Library data of the parts
C30 C32-C34 = CMP-001-00661-1: as C4 on sheet MCU_PWR; Packaging: Tape and Reel; Height: 0.8mm; Mount: Surface Mount; Source: WCAP-CSGP.SchLib; Component Type: Standard; Category: Multilayer Ceramic Chip Capacitors; Operating Temperature Min: -55°C; Case/Package: 0603; ComponentLink2Description: Datasheet Link; Width: 0.8mm; ComponentLink1URL: https://www.we-online.com/redexpert/article/885012206071?ad; Length: 1.6mm; Operating Temperature Max: 125°C; Match Code: WCAP-CSGP; ComponentLink2URL: https://www.we-online.com/redexpert/spec/885012206071?ad; Design Item ID: 885012206071; ComponentLink1Description: Website Link; Manufacturer Part Number: 885012206071; Pins: 2; Ceramic Type: X7R
C31 = CMP-001-00440-1: as C3 on sheet MCU_PWR; ComponentLink2URL: https://www.we-online.com/redexpert/spec/885012106012?ad; Height: 0.8mm; Packaging: Tape and Reel; Case/Package: 0603; Manufacturer Part Number: 885012106012; Component Type: Standard; Width: 0.8mm; Match Code: WCAP-CSGP; Mount: Surface Mount; Ceramic Type: X5R; Operating Temperature Max: 85°C; ComponentLink1Description: Website Link; Length: 1.6mm; ComponentLink1URL: https://www.we-online.com/redexpert/article/885012106012?ad; ComponentLink2Description: Datasheet Link; Category: Multilayer Ceramic Chip Capacitors; Source: WCAP-CSGP.SchLib; Operating Temperature Min: -55°C; Pins: 2; Design Item ID: 885012106012
D9 = CMP-004-00017-1: as D1 on sheet Connectors; Source: WE-TVS.SchLib; Component Type: Standard; Packaging: Tape and Reel; Height: 1.45mm; Pins: 6; Match Code: WE-TVS; Case/Package: SOT23-6L; Mount: Surface Mount; Channel Operating Voltage: 5V; ComponentLink1Description: Website Link; ComponentLink2URL: https://www.we-online.com/redexpert/spec/82400102?ad; Category: ESD Protection; Channel Input Capacitance: 2pF; Operating Temperature Min: -40°C; ComponentLink1URL: https://www.we-online.com/redexpert/article/82400102?ad; Length: 2.9mm; Width: 2.8mm; Manufacturer Part Number: 82400102; Design Item ID: 82400102; ComponentLink2Description: Datasheet Link; Operating Temperature Max: 125°C; Number of Channels: 2+1
J1 = CMP-133-000027-1: WR-COM USB 2.0 Type C Receptacle Horizontal SMT; Manufacturer: Wurth Elektronik; Interface Type: Type C; Rated Current: 5A; Working Voltage: 20V (DC); Match Code: WR-USB; Number of Ports: 1; Orientation: Horizontal; Application: USB 2.0; ComponentLink1Description: Website Link; Gender: Receptacle; Operating Temperature Min: -40°C; Category: Input/Output Connectors; Pin Count: 13; Packaging: Tape and Reel; Operating Temperature Max: 85°C; ComponentLink1URL: https://www.we-online.com/redexpert/article/629722000214?ad; Component Type: Standard; ComponentLink2URL: https://www.we-online.com/redexpert/spec/629722000214?ad; Design Item ID: 629722000214; Number of Pins: 16; Source: WR-USB.SchLib; Manufacturer Part Number: 629722000214; Mount: Surface Mount; ComponentLink2Description: Datasheet Link
MOD1 = CMP-169-000025-1: Thyone-I - Radio Modules 2.4 GHz; Operating Supply Voltage max.: 3.6V; Operating Supply Voltage min.: 1.8V; Frequency: 2402-2480MHz; RX sensitivity e.r.p.: –; RF Bitrate max.: 2000kbps; Line of Sight Range: 750m; Source: WE_WIRL_Rev15.SchLib; Published Date: April 2019; Operating Temperature: -40 to +85 degC; Publisher: Wurth Elektronik; Design Item ID: WIRL-PRO2_2611011021000; ComponentLink1URL: http://www.we-online.de; ComponentLink2Description: Datasheet; ComponentLink1Description: Manufacturer; Packaging: Tape and Reel; Mounting Technology: SMT; Part Number: 2611011021000; ComponentLink2URL: https://katalog.we-online.de/wco/datasheet/2611011021000.pdf; Output Power e.r.p.: –
Q2 Q3 = CMP-015-00003-4: Enhanced automotive CAN transceiver with standby 8-SOT-23-THIN -40 to 150
R12 R13 = CMP-009-00119-3: Fixed Resistor, Metal Glaze/thick Film, 0.4W, 120ohm, 150V, 1% +/-Tol, 100ppm/Cel, Surface Mount, 0805; Power: 500mW; Case/Package: 0805; Mounting Technology: SMD; Pins: 2
R14 R15 = CMP-009-00329-1: WRIS-RSKS Thick Film Resistor, size 0603, 4700Ohm, 100mW; Manufacturer: Wurth Elektronik; Temperature Coefficient of Resistance Max: 100ppm/°C; Limiting Element Voltage: 75V; Temperature Coefficient of Resistance Min: -100ppm/°C; Resistance Tolerance: +/-1%; Height: 0.45mm; Category: Thick Film Resistors; Operating Temperature Min: -55°C; ComponentLink2URL: https://www.we-online.com/redexpert/spec/560112116006?ad; Mount: Surface Mount; ComponentLink1URL: https://www.we-online.com/redexpert/article/560112116006?ad; Packaging: Tape and Reel; Width: 0.8mm; Pins: 2; Component Type: Standard; Length: 1.6mm; ComponentLink2Description: Datasheet Link; Manufacturer Part Number: 560112116006; Source: WRIS-RSKS.SchLib; ComponentLink1Description: Website Link; Rated Power: 100mW; Match Code: WRIS-RSKS; Design Item ID: 560112116006; Operating Temperature Max: 155°C; Case/Package: 0603

## Sheet Storage.SchDoc
size A4; SheetNumber: 6; SheetTotal: 7; SPICEModelCacheNPRVAKVK: <root> / <DocumentId>NPRVAKVK</DocumentId> / </root>
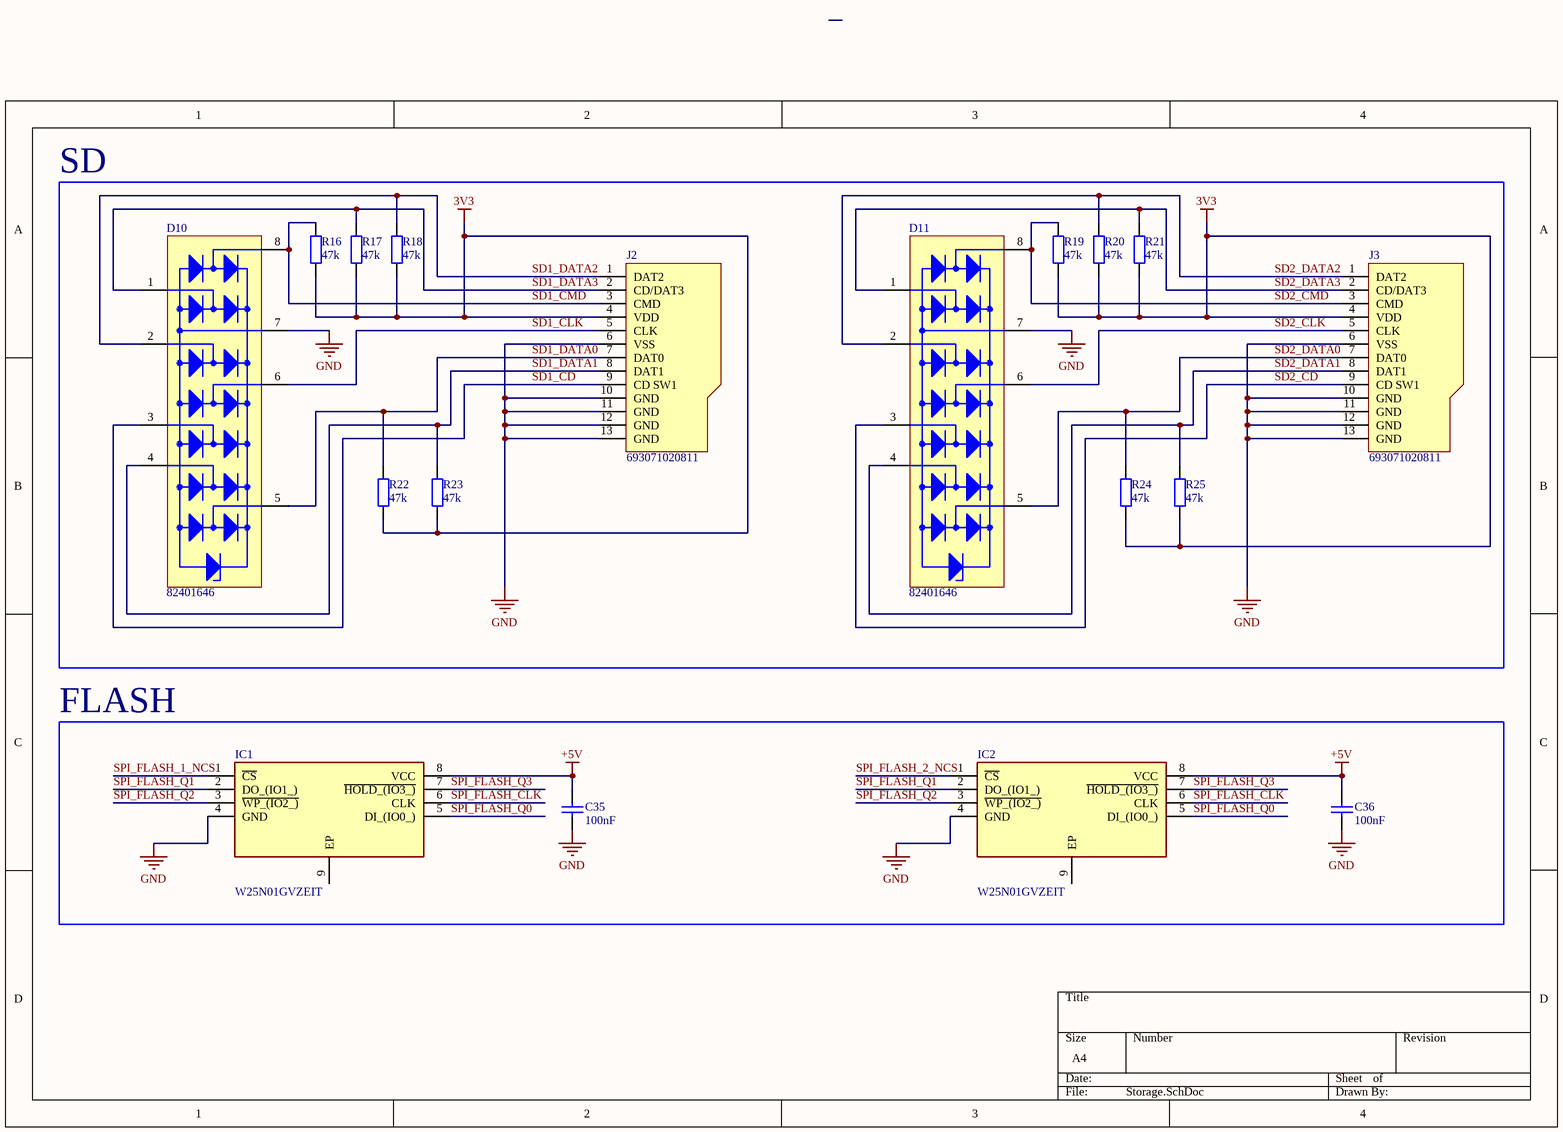
[diagram p6: Storage.SchDoc]

### Parts
C35  value 100nF  [WCAP-CSGP_0603_L1.6W0.8H0.8_Reflow]  (hidden comment: 885012206071)
C36  value 100nF  [WCAP-CSGP_0603_L1.6W0.8H0.8_Reflow]  (hidden comment: 885012206071)
D10  82401646  [WE-TVS_MSOP-8L]
D11  82401646  [WE-TVS_MSOP-8L]
IC1  W25N01GVZEIT  [SON127P800X600X80-9N-D]
IC2  W25N01GVZEIT  [SON127P800X600X80-9N-D]
J2  693071020811  [693071020811]
J3  693071020811  [693071020811]
R16  value 47k  [WRIS-RSKS_0603_Reflow]  (hidden comment: 560112116025)
R17  value 47k  [WRIS-RSKS_0603_Reflow]  (hidden comment: 560112116025)
R18  value 47k  [WRIS-RSKS_0603_Reflow]  (hidden comment: 560112116025)
R19  value 47k  [WRIS-RSKS_0603_Reflow]  (hidden comment: 560112116025)
R20  value 47k  [WRIS-RSKS_0603_Reflow]  (hidden comment: 560112116025)
R21  value 47k  [WRIS-RSKS_0603_Reflow]  (hidden comment: 560112116025)
R22  value 47k  [WRIS-RSKS_0603_Reflow]  (hidden comment: 560112116025)
R23  value 47k  [WRIS-RSKS_0603_Reflow]  (hidden comment: 560112116025)
R24  value 47k  [WRIS-RSKS_0603_Reflow]  (hidden comment: 560112116025)
R25  value 47k  [WRIS-RSKS_0603_Reflow]  (hidden comment: 560112116025)

### Blocks framed on the sheet
SD: D10 D11 J2 J3 R16-R25
FLASH: C35 C36 IC1 IC2

### Nets
3V3: J2.4(VDD) J3.4(VDD) R16.1 R17.1 R18.1 R19.1 R20.1 R21.1 R22.1 R23.1 R24.1 R25.1  [project net 3V3_Current-]
+5V: C35.2 C36.2 IC1.8(VCC) IC2.8(VCC)  [project net 5V_Current-]
GND: C35.1 C36.1 D10.7(GND) D11.7(GND) IC1.4(GND) IC2.4(GND) J2.6(VSS) J2.10(GND) J2.11(GND) J2.12(GND) J2.13(GND) J3.6(VSS) J3.10(GND) J3.11(GND) J3.12(GND) J3.13(GND)
SD1_CD: D10.3(I/O_3) J2.9(CD_SW1)
SD1_CLK: D10.6(I/O_6) J2.5(CLK)
SD1_CMD: D10.8(VDD) J2.3(CMD) R16.2
SD1_DATA0: D10.5(I/O_5) J2.7(DAT0) R22.2
SD1_DATA1: D10.4(I/O_4) J2.8(DAT1) R23.2
SD1_DATA2: D10.2(I/O_2) J2.1(DAT2) R18.2
SD1_DATA3: D10.1(I/O_1) J2.2(CD/DAT3) R17.2
SD2_CD: D11.3(I/O_3) J3.9(CD_SW1)
SD2_CLK: D11.6(I/O_6) J3.5(CLK)
SD2_CMD: D11.8(VDD) J3.3(CMD) R19.2
SD2_DATA0: D11.5(I/O_5) J3.7(DAT0) R24.2
SD2_DATA1: D11.4(I/O_4) J3.8(DAT1) R25.2
SD2_DATA2: D11.2(I/O_2) J3.1(DAT2) R20.2
SD2_DATA3: D11.1(I/O_1) J3.2(CD/DAT3) R21.2
SPI_FLASH_1_NCS: IC1.1(~{CS})
SPI_FLASH_2_NCS: IC2.1(~{CS})
SPI_FLASH_CLK: IC1.6(CLK) IC2.6(CLK)
SPI_FLASH_Q0: IC1.5(DI_(IO0_)) IC2.5(DI_(IO0_))
SPI_FLASH_Q1: IC1.2(DO_(IO1_)) IC2.2(DO_(IO1_))
SPI_FLASH_Q2: IC1.3(~{WP_(IO2_)}) IC2.3(~{WP_(IO2_)})
SPI_FLASH_Q3: IC1.7(~{HOLD_(IO3_)}) IC2.7(~{HOLD_(IO3_)})

Not connected (* = marked no-connect by the designer): IC1 9(EP); IC2 9(EP)

### Library data of the parts
C35 C36 = CMP-001-00661-1: as C4 on sheet MCU_PWR; Packaging: Tape and Reel; Height: 0.8mm; Mount: Surface Mount; Source: WCAP-CSGP.SchLib; Component Type: Standard; Category: Multilayer Ceramic Chip Capacitors; Operating Temperature Min: -55°C; Case/Package: 0603; ComponentLink2Description: Datasheet Link; Width: 0.8mm; ComponentLink1URL: https://www.we-online.com/redexpert/article/885012206071?ad; Length: 1.6mm; Operating Temperature Max: 125°C; Match Code: WCAP-CSGP; ComponentLink2URL: https://www.we-online.com/redexpert/spec/885012206071?ad; Design Item ID: 885012206071; ComponentLink1Description: Website Link; Manufacturer Part Number: 885012206071; Pins: 2; Ceramic Type: X7R
D10 D11 = CMP-004-00042-1: WE-TVS TVS Diode – Super Speed Series, MSOP-8L, 6+1 Channel, 5V, 0.2pF; Manufacturer: Wurth Elektronik; (Reverse) Peak Pulse Current: 2.5A; ESD Contact Discharge Capability: 8kV; ESD Air Discharge Capability: 15kV; Polarity: Unidirectional; Channel Reverse Leakage Current: 1uA; Channel ESD Clamping Voltage: 13V; (Reverse) Breakdown Voltage: 6V; Channel Operating Voltage: 5V; ComponentLink1Description: Website Link; Number of Channels: 6+1; Source: WE-TVS.SchLib; Design Item ID: 82401646; Pins: 8; Packaging: Tape and Reel; Match Code: WE-TVS; Width: 3mm; ComponentLink2Description: Datasheet Link; Length: 4.9mm; Component Type: Standard; ComponentLink1URL: https://www.we-online.com/redexpert/article/82401646?ad; Operating Temperature Min: -55°C; ComponentLink2URL: https://www.we-online.com/redexpert/spec/82401646?ad; Mount: Surface Mount; Category: ESD Protection; Operating Temperature Max: 85°C; Manufacturer Part Number: 82401646; Case/Package: MSOP-8L; Height: 0.96mm; Channel Input Capacitance: 0.2pF
IC1 IC2 = W25N01GVZEIT: Integrated Circuit; Manufacturer_Name: Winbond; Datasheet Link: https://www.winbond.com/hq/search-resource-file.jsp?partNo=W25N01GVZEIT&type=datasheet; Height: 0.8mm; Manufacturer_Part_Number: W25N01GVZEIT; Mouser Part Number: 454-W25N01GVZEIT; Mouser Price/Stock: https://www.mouser.co.uk/ProductDetail/Winbond/W25N01GVZEIT?qs=qSfuJ%252Bfl%2Fd62yqJfJtnOQw%3D%3D; Arrow Part Number: W25N01GVZEIT; Arrow Price/Stock: https://www.arrow.com/en/products/w25n01gvzeit/winbond-electronics?region=nac
J2 J3 = CMP-002-00279-1: WR-CRD Micro SD Card Connector Push & Push; Manufacturer: Wurth Elektronik; Withstanding Voltage: 500VAC; Gender: Socket; Contact Resistance: 100mOhm; Working Voltage: 30VAC; Rated Current: 0.5A; ComponentLink2URL: https://www.we-online.com/redexpert/spec/693071020811?ad; Manufacturer Part Number: 693071020811; Pin Count: 13; Type: Push & Push; Packaging: Tape and Reel; Mount: Surface Mount; Source: WR-CRD.SchLib; Match Code: WR-CRD; ComponentLink1Description: Website Link; ComponentLink2Description: Datasheet Link; Component Type: Standard; Operating Temperature Min: -40°C; Pins: 8; ComponentLink1URL: https://www.we-online.com/redexpert/article/693071020811?ad; Operating Temperature Max: 85°C; Design Item ID: 693071020811; Category: Input/Output Connectors
R16-R25 = CMP-009-00348-1: WRIS-RSKS Thick Film Resistor, size 0603, 47000Ohm, 100mW; Manufacturer: Wurth Elektronik; Resistance Tolerance: +/-1%; Limiting Element Voltage: 75V; Temperature Coefficient of Resistance Min: -100ppm/°C; Temperature Coefficient of Resistance Max: 100ppm/°C; Height: 0.45mm; Operating Temperature Min: -55°C; Category: Thick Film Resistors; ComponentLink1URL: https://www.we-online.com/redexpert/article/560112116025?ad; Match Code: WRIS-RSKS; Case/Package: 0603; Operating Temperature Max: 155°C; Design Item ID: 560112116025; Component Type: Standard; Packaging: Tape and Reel; ComponentLink2URL: https://www.we-online.com/redexpert/spec/560112116025?ad; Pins: 2; Manufacturer Part Number: 560112116025; Width: 0.8mm; Rated Power: 100mW; Source: WRIS-RSKS.SchLib; Length: 1.6mm; ComponentLink2Description: Datasheet Link; ComponentLink1Description: Website Link; Mount: Surface Mount